# Altium schematic sheet eeprom24c32.SchDoc
size A4; DocumentNumber: 7; SheetNumber: 7; SheetTotal: 11
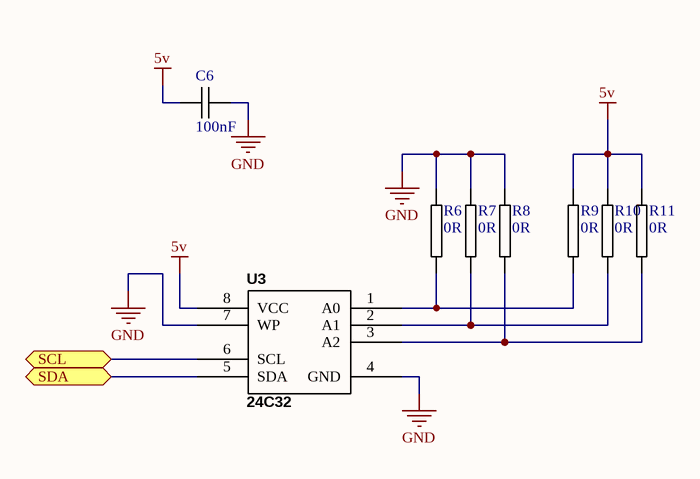
[diagram p0: eeprom24c32.SchDoc]

## Parts
C6  100nF  [0805C-TBD]
R6  0R  [0805R-GENERIC]
R7  0R  [0805R-GENERIC]
R8  0R  [0805R-GENERIC]
R9  0R  [0805R-GENERIC]
R10  0R  [0805R-GENERIC]
R11  0R  [0805R-GENERIC]
U3  24C32  [SO8]

## Ports
SCL, SDA

## Nets
5v: C6.1 R9.2 R10.2 R11.2 U3.8(VCC)
GND: C6.2 R6.2 R7.2 R8.2 U3.4(GND) U3.7(WP)
SCL: U3.6(SCL) ; port SCL
SDA: U3.5(SDA) ; port SDA
NetR6_1: R6.1 R9.1 U3.1(A0)
NetR7_1: R7.1 R10.1 U3.2(A1)
NetR8_1: R8.1 R11.1 U3.3(A2)

## Library data of the parts
C6 = 0805C-100nF-25V-X7R-MUR: CAPACITOR 0805 CERAMIC; Supplier 1: Digi-Key; Supplier Part Number 1: 490-1673-1-ND
R6-R11 = 0805R-0R: RESISTOR 0805 1 WATT
U3 = 24C32: I2C EEPROM 4K X 8; Part Field 1: STM; Manufacturer Part Number: M24C32-WMN6TP; Manufacturer: STMicroelectronics; Description: IC EEPROM 32KBIT 400KHZ 8SOIC; Reel: U3; Part Field 2: M24C32-WMN6TP; Part Field 3: Digi-Key; Part Field 4: 497-5027-6-ND; Part Field 5: SERIAL I2C EEPROM; Supplier 1: Digi-Key; Supplier Part Number 1: 497-5027-2-ND